# Altium schematic sheet Rear ECU.SchDoc
size A4
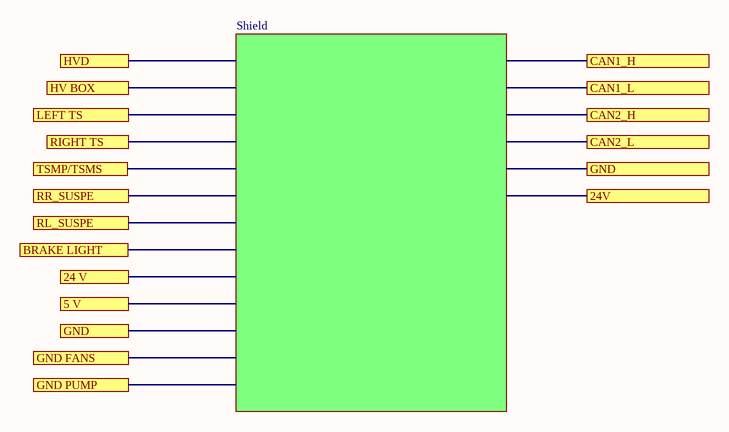
[diagram p0: Rear ECU.SchDoc]

## Sub-sheets
Designator = Shield : no entries

## Ports
5 V, 24 V, 24V (see Front_ECU[3B]), BRAKE LIGHT, CAN1_H (see Front_ECU[3A]), CAN1_L (see Front_ECU[3A]), CAN2_H (see Front_ECU[3B]), CAN2_L (see Front_ECU[3B]), GND (see Front_ECU[3B], Rear ECU[2C]), GND (see Front_ECU[3B], Rear ECU[3B]), GND FANS, GND PUMP , HV BOX, HVD, LEFT TS, RIGHT TS, RL_SUSPE, RR_SUSPE, TSMP/TSMS